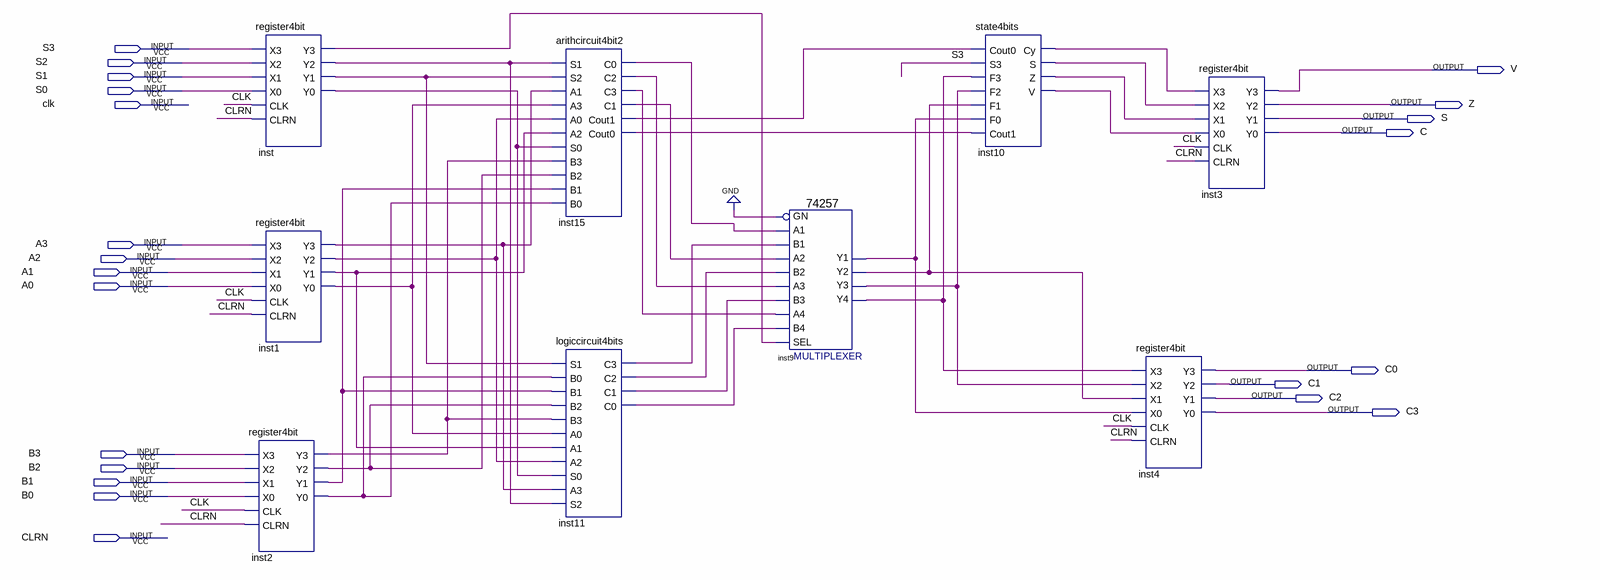
[diagram p0: schematic sheet]
// Quartus schematic Lab3top.bdf as structural Verilog: 9 symbols, 22 pins
module Lab3top (
  input  S3,
  input  S2,
  input  S1,
  input  S0,
  input  clk,
  input  A3,
  input  A2,
  input  A1,
  input  A0,
  input  B3,
  input  B2,
  input  B1,
  input  B0,
  input  CLRN,
  output V,
  output Z,
  output S,
  output C,
  output C0,
  output C1,
  output C2,
  output C3
);

  wire inst1_y0, inst1_y1, inst1_y2, inst1_y3, inst2_y0, inst2_y1, inst2_y2, inst2_y3, inst9_y1, inst9_y2,
       inst9_y3, inst9_y4, inst10_cy, inst10_s, inst10_v, inst10_z, inst11_c0, inst11_c1, inst11_c2,
       inst11_c3, inst15_c0, inst15_c1, inst15_c2, inst15_c3, inst15_cout0, inst15_cout1, inst_y0, inst_y1,
       inst_y2, inst_y3;

  register4bit inst (
    .X3(S3), .X2(S2), .X1(S1), .X0(S0), .CLK(clk), .CLRN(CLRN), .Y3(inst_y3), .Y2(inst_y2), .Y1(inst_y1),
    .Y0(inst_y0));
  register4bit inst1 (
    .X3(A3), .X2(A2), .X1(A1), .X0(A0), .CLK(clk), .CLRN(CLRN), .Y3(inst1_y3), .Y2(inst1_y2), .Y1(inst1_y1),
    .Y0(inst1_y0));
  register4bit inst2 (
    .X3(B3), .X2(B2), .X1(B1), .X0(B0), .CLK(clk), .CLRN(CLRN), .Y3(inst2_y3), .Y2(inst2_y2), .Y1(inst2_y1),
    .Y0(inst2_y0));
  arithcircuit4bit2 inst15 (
    .S1(inst_y2), .S2(inst_y1), .A1(inst1_y3), .A3(inst1_y0), .A0(inst1_y2), .A2(inst1_y1), .S0(inst_y0),
    .B3(inst2_y3), .B2(inst2_y2), .B1(inst2_y1), .B0(inst2_y0), .C0(inst15_c0), .C2(inst15_c2),
    .C3(inst15_c3), .C1(inst15_c1), .Cout1(inst15_cout1), .Cout0(inst15_cout0));
  logiccircuit4bits inst11 (
    .S1(inst_y1), .B0(inst2_y0), .B1(inst2_y1), .B2(inst2_y2), .B3(inst2_y3), .A0(inst1_y0), .A1(inst1_y1),
    .A2(inst1_y2), .S0(inst_y0), .A3(inst1_y3), .S2(inst_y2), .C3(inst11_c3), .C2(inst11_c2), .C1(inst11_c1),
    .C0(inst11_c0));
  \74257  inst9 (
    .B1(inst11_c3), .A1(inst15_c0), .B3(inst11_c1), .A2(inst15_c1), .B2(inst11_c2), .A3(inst15_c2),
    .A4(inst15_c3), .B4(inst11_c0), .SEL(inst_y3), .GN(1'b0), .Y2(inst9_y2), .Y3(inst9_y3), .Y4(inst9_y4),
    .Y1(inst9_y1));
  state4bits inst10 (
    .Cout0(inst15_cout1), .S3(S3), .F3(inst9_y4), .F2(inst9_y3), .F1(inst9_y2), .F0(inst9_y1),
    .Cout1(inst15_cout0), .Cy(inst10_cy), .S(inst10_s), .Z(inst10_z), .V(inst10_v));
  register4bit inst4 (
    .X3(inst9_y4), .X2(inst9_y3), .X1(inst9_y2), .X0(inst9_y1), .CLK(clk), .CLRN(CLRN), .Y3(C0), .Y2(C1),
    .Y1(C2), .Y0(C3));
  register4bit inst3 (
    .X3(inst10_cy), .X2(inst10_s), .X1(inst10_z), .X0(inst10_v), .CLK(clk), .CLRN(CLRN), .Y3(V), .Y2(Z),
    .Y1(S), .Y0(C));
endmodule
